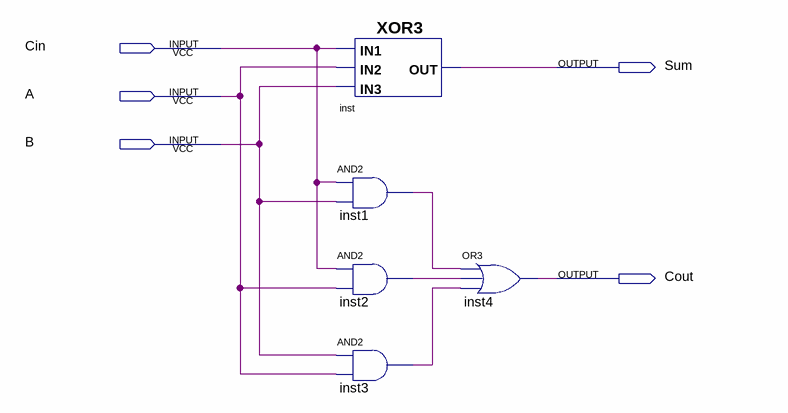
[diagram p0: schematic sheet]
// Quartus schematic FullAdder.bdf as structural Verilog: 5 symbols, 5 pins
module FullAdder (
  input  Cin,
  input  A,
  input  B,
  output Sum,
  output Cout
);

  wire inst1_out, inst2_out, inst3_out;

  XOR3 inst (.IN3(B), .IN1(Cin), .IN2(A), .OUT(Sum));
  and inst1 (inst1_out, Cin, B);
  and inst2 (inst2_out, Cin, A);
  and inst3 (inst3_out, B, A);
  or inst4 (Cout, inst1_out, inst2_out, inst3_out);
endmodule
